# Altium schematic sheet RP2040 Core Sheet.SchDoc
size B; SheetNumber: 3; SheetTotal: 5
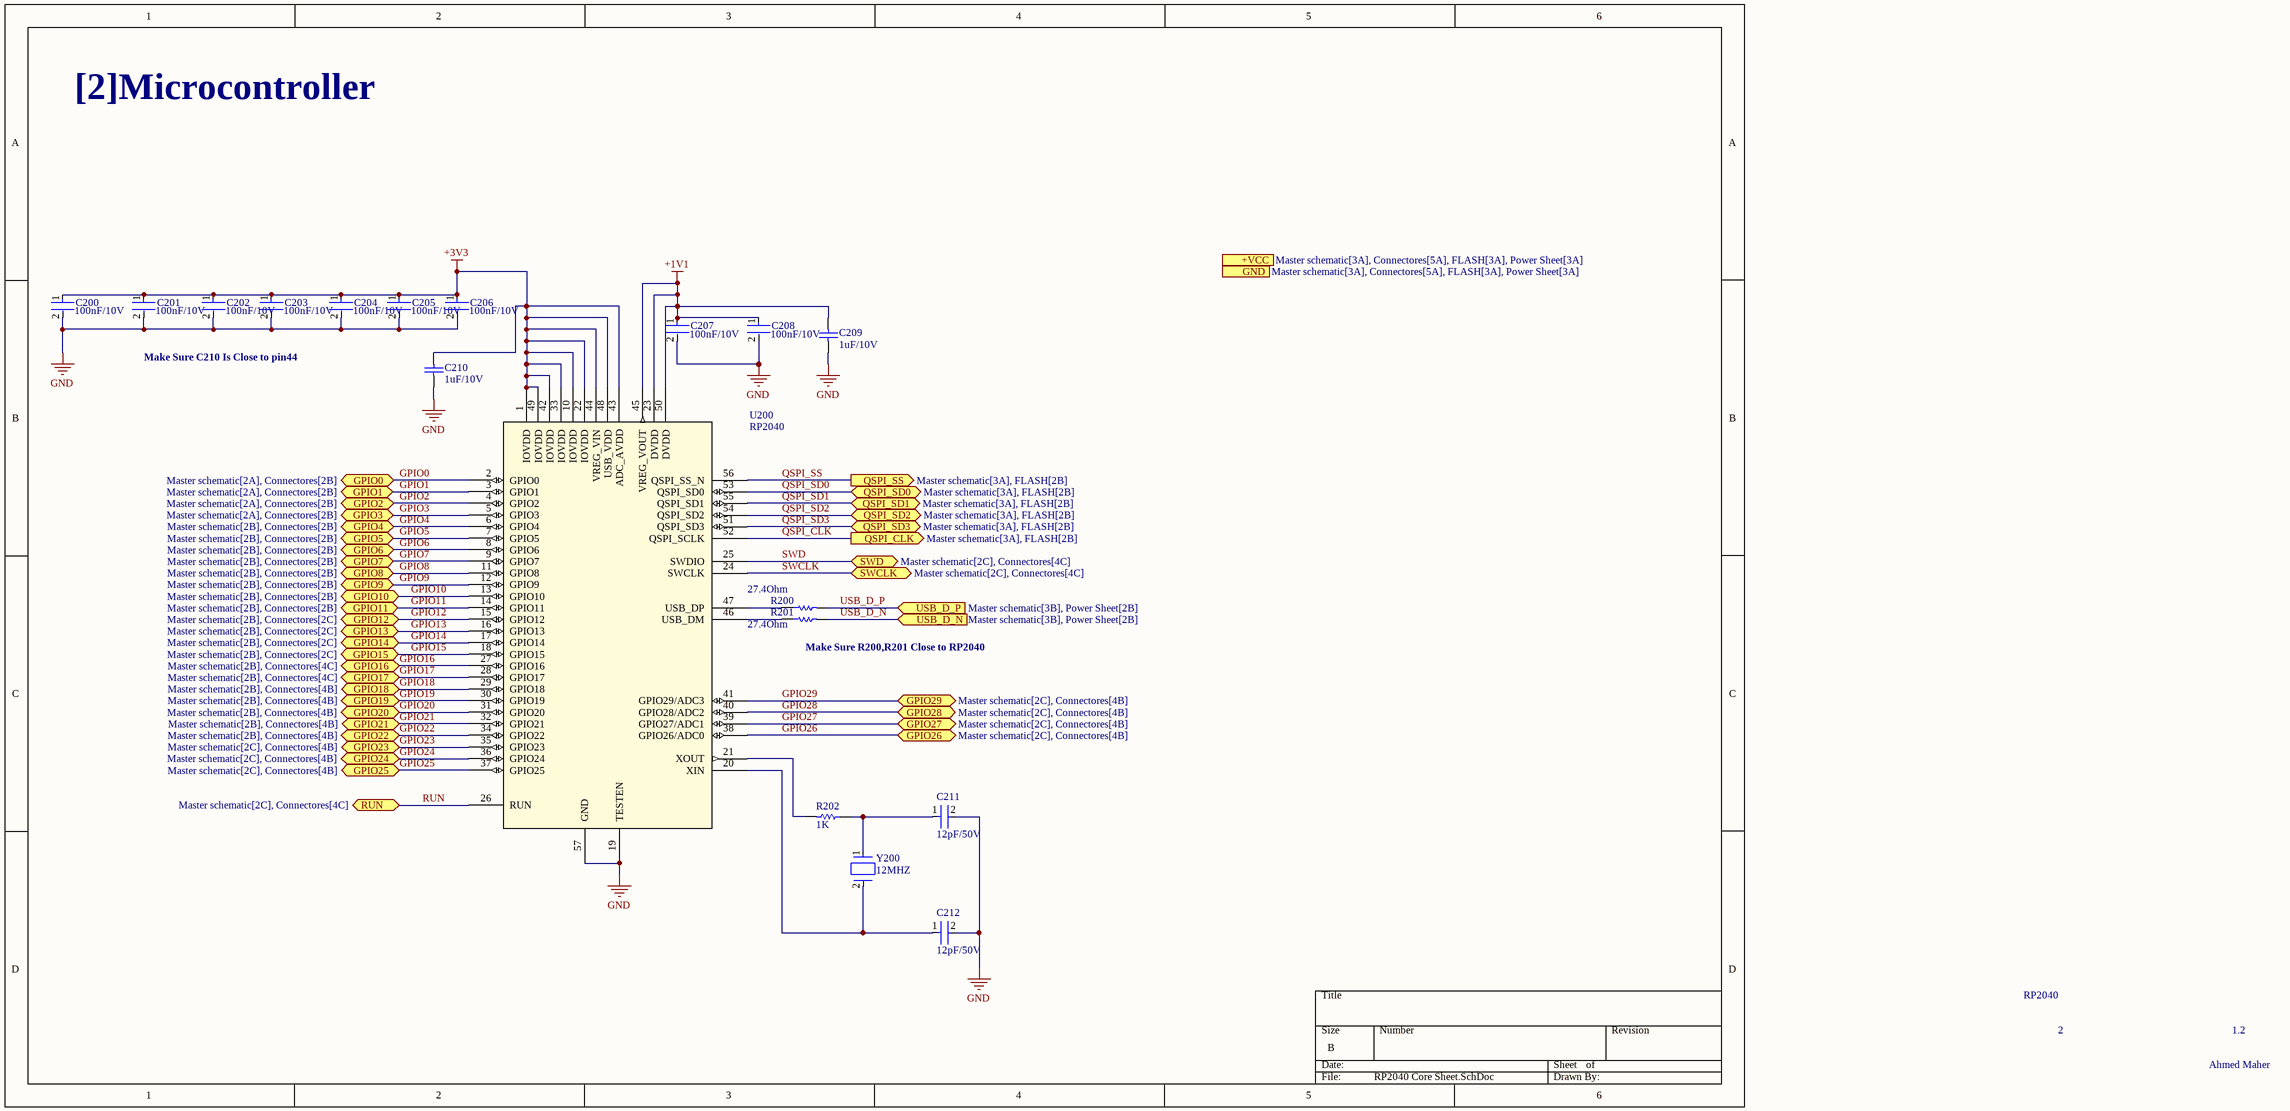
[diagram p0: RP2040 Core Sheet.SchDoc]

## Parts
C200  C0402C104K8PACTU  [FP-C0402-BB-MFG]  (value not drawn)
C201  C0402C104K8PACTU  [FP-C0402-BB-MFG]  (value not drawn)
C202  C0402C104K8PACTU  [FP-C0402-BB-MFG]  (value not drawn)
C203  C0402C104K8PACTU  [FP-C0402-BB-MFG]  (value not drawn)
C204  C0402C104K8PACTU  [FP-C0402-BB-MFG]  (value not drawn)
C205  C0402C104K8PACTU  [FP-C0402-BB-MFG]  (value not drawn)
C206  C0402C104K8PACTU  [FP-C0402-BB-MFG]  (value not drawn)
C207  C0402C104K8PACTU  [FP-C0402-BB-MFG]  (value not drawn)
C208  C0402C104K8PACTU  [FP-C0402-BB-MFG]  (value not drawn)
C209  1uF/10V  [CAPC1608X87X35LL15T15]
C210  1uF/10V  [CAPC1608X87X35LL15T15]
C211  12pF/50V  [FP-CC0603-0_9-MFG]
C212  12pF/50V  [FP-CC0603-0_9-MFG]
R200  RC0603FR-07274RL  [RESC1608X55X25NL10T15]  (value not drawn)
R201  RC0603FR-07274RL  [RESC1608X55X25NL10T15]  (value not drawn)
R202  1K  [RESC2013X60X35ML10T20]
U200  RP2040  [IC57_RP2040]
Y200  12MHZ  [FP-7A-MFG]

## Ports
+VCC (see Master schematic[3A], Connectores[5A], FLASH[3A], Power Sheet[3A]), GND (see Master schematic[3A], Connectores[5A], FLASH[3A], Power Sheet[3A]), GPIO0 (bidir, see Master schematic[2A], Connectores[2B]), GPIO1 (bidir, see Master schematic[2A], Connectores[2B]), GPIO2 (bidir, see Master schematic[2A], Connectores[2B]), GPIO3 (bidir, see Master schematic[2A], Connectores[2B]), GPIO4 (bidir, see Master schematic[2B], Connectores[2B]), GPIO5 (bidir, see Master schematic[2B], Connectores[2B]), GPIO6 (bidir, see Master schematic[2B], Connectores[2B]), GPIO7 (bidir, see Master schematic[2B], Connectores[2B]), GPIO8 (bidir, see Master schematic[2B], Connectores[2B]), GPIO9 (bidir, see Master schematic[2B], Connectores[2B]), GPIO10 (bidir, see Master schematic[2B], Connectores[2B]), GPIO11 (bidir, see Master schematic[2B], Connectores[2B]), GPIO12 (bidir, see Master schematic[2B], Connectores[2C]), GPIO13 (bidir, see Master schematic[2B], Connectores[2C]), GPIO14 (bidir, see Master schematic[2B], Connectores[2C]), GPIO15 (bidir, see Master schematic[2B], Connectores[2C]), GPIO16 (bidir, see Master schematic[2B], Connectores[4C]), GPIO17 (bidir, see Master schematic[2B], Connectores[4C]), GPIO18 (bidir, see Master schematic[2B], Connectores[4B]), GPIO19 (bidir, see Master schematic[2B], Connectores[4B]), GPIO20 (bidir, see Master schematic[2B], Connectores[4B]), GPIO21 (bidir, see Master schematic[2B], Connectores[4B]), GPIO22 (bidir, see Master schematic[2B], Connectores[4B]), GPIO23 (bidir, see Master schematic[2C], Connectores[4B]), GPIO24 (bidir, see Master schematic[2C], Connectores[4B]), GPIO25 (bidir, see Master schematic[2C], Connectores[4B]), GPIO26 (bidir, see Master schematic[2C], Connectores[4B]), GPIO27 (bidir, see Master schematic[2C], Connectores[4B]), GPIO28 (bidir, see Master schematic[2C], Connectores[4B]), GPIO29 (bidir, see Master schematic[2C], Connectores[4B]), QSPI_CLK (out, see Master schematic[3A], FLASH[2B]), QSPI_SD0 (bidir, see Master schematic[3A], FLASH[2B]), QSPI_SD1 (bidir, see Master schematic[3A], FLASH[2B]), QSPI_SD2 (bidir, see Master schematic[3A], FLASH[2B]), QSPI_SD3 (bidir, see Master schematic[3A], FLASH[2B]), QSPI_SS (out, see Master schematic[3A], FLASH[2B]), RUN (bidir, see Master schematic[2C], Connectores[4C]), SWCLK (bidir, see Master schematic[2C], Connectores[4C]), SWD (bidir, see Master schematic[2C], Connectores[4C]), USB_D_N (in, see Master schematic[3B], Power Sheet[2B]), USB_D_P (in, see Master schematic[3B], Power Sheet[2B])

## Nets
+1V1: C207.1 C208.1 C209.1 U200.23(DVDD) U200.45(VREG_VOUT) U200.50(DVDD)
+3V3: C200.1 C201.1 C202.1 C203.1 C204.1 C205.1 C206.1 C210.1 U200.1(IOVDD) U200.10(IOVDD) U200.22(IOVDD) U200.33(IOVDD) U200.42(IOVDD) U200.43(ADC_AVDD) U200.44(VREG_VIN) U200.48(USB_VDD) U200.49(IOVDD)
GND: C200.2 C201.2 C202.2 C203.2 C204.2 C205.2 C206.2 C207.2 C208.2 C209.2 C210.2 C211.2 C212.2 U200.19(TESTEN) U200.57(GND)
GPIO0: U200.2(GPIO0) ; port GPIO0
GPIO1: U200.3(GPIO1) ; port GPIO1
GPIO2: U200.4(GPIO2) ; port GPIO2
GPIO3: U200.5(GPIO3) ; port GPIO3
GPIO4: U200.6(GPIO4) ; port GPIO4
GPIO5: U200.7(GPIO5) ; port GPIO5
GPIO6: U200.8(GPIO6) ; port GPIO6
GPIO7: U200.9(GPIO7) ; port GPIO7
GPIO8: U200.11(GPIO8) ; port GPIO8
GPIO9: U200.12(GPIO9) ; port GPIO9
GPIO10: U200.13(GPIO10) ; port GPIO10
GPIO11: U200.14(GPIO11) ; port GPIO11
GPIO12: U200.15(GPIO12) ; port GPIO12
GPIO13: U200.16(GPIO13) ; port GPIO13
GPIO14: U200.17(GPIO14) ; port GPIO14
GPIO15: U200.18(GPIO15) ; port GPIO15
GPIO16: U200.27(GPIO16) ; port GPIO16
GPIO17: U200.28(GPIO17) ; port GPIO17
GPIO18: U200.29(GPIO18) ; port GPIO18
GPIO19: U200.30(GPIO19) ; port GPIO19
GPIO20: U200.31(GPIO20) ; port GPIO20
GPIO21: U200.32(GPIO21) ; port GPIO21
GPIO22: U200.34(GPIO22) ; port GPIO22
GPIO23: U200.35(GPIO23) ; port GPIO23
GPIO24: U200.36(GPIO24) ; port GPIO24
GPIO25: U200.37(GPIO25) ; port GPIO25
GPIO26: U200.38(GPIO26/ADC0) ; port GPIO26
GPIO27: U200.39(GPIO27/ADC1) ; port GPIO27
GPIO28: U200.40(GPIO28/ADC2) ; port GPIO28
GPIO29: U200.41(GPIO29/ADC3) ; port GPIO29
QSPI_CLK: U200.52(QSPI_SCLK) ; port QSPI_CLK
QSPI_SD0: U200.53(QSPI_SD0) ; port QSPI_SD0
QSPI_SD1: U200.55(QSPI_SD1) ; port QSPI_SD1
QSPI_SD2: U200.54(QSPI_SD2) ; port QSPI_SD2
QSPI_SD3: U200.51(QSPI_SD3) ; port QSPI_SD3
QSPI_SS: U200.56(QSPI_SS_N) ; port QSPI_SS
RUN: U200.26(RUN) ; port RUN
SWCLK: U200.24(SWCLK) ; port SWCLK
SWD: U200.25(SWDIO) ; port SWD
USB_D_N: R201.2 ; port USB_D_N
USB_D_P: R200.2 ; port USB_D_P
NetC211_1: C211.1 R202.1 Y200.1
NetC212_1: C212.1 U200.20(XIN) Y200.2
NetR200_1: R200.1 U200.47(USB_DP)
NetR201_1: R201.1 U200.46(USB_DM)
NetR202_2: R202.2 U200.21(XOUT)

## Notes on the sheet
- [2]Microcontroller
- (near C200) 100nF/10V
- 100nF/10V
- (near C203) 100nF/10V
- (near C205) 100nF/10V
- (near C206) 100nF/10V
- Make Sure C210 Is Close to pin44
- (near C207) 100nF/10V
- 27.4Ohm
- Make Sure R200,R201 Close to RP2040
- RP2040
- 2
- Ahmed Maher
- 1.2

## Library data of the parts
C200-C208 = CMP-2008-02046-2: CAP CER 0.1UF 10V X5R 0402; Manufacturer: Kemet; Material: Ceramic; Capacitance: 0.10 μF; Temperature Coefficient: 15%; Tolerance: 0.1; Value: 0.10 μF; Package: C0402-BB; Temperature: -55°C to +125°C; ComponentLink2Description: Datasheet; Temperature Characteristic: X5R; Device Class L1: Passive Components; Height: 0.55mm; Lead Free: Yes; ComponentLink2URL: https://content.kemet.com/datasheets/KEM_C1002_X7R_SMD.pdf; Device Class L2: Capacitors; Temperature Range Low: -55°C; Temperature Range High: +125°C; RoHS: TRUE; Octopart: https://octopart.com/c0402c104k8pactu-kemet-140039; Automotive: No; Mouser Description: Capacitor 100 nF 10 VDC 0402; Category: Cap; Voltage Rating: 10 V; Digikey Description: CAP CER 0.1UF 10V X5R 0402; Ipc Land Pattern Name: CAPC10050X50; Device Class L3: Ceramic Capacitors; Manufacturer Part Number: C0402C104K8PACTU
C209 C210 = CMP-2006-03713-1: Part Number: C0603C105K3RACTU; Manufacturer: Kemet
C211 C212 = CMP-03422-001493-1: CAP CER 15PF 50V C0G/NPO 0603; Insulation Resistance: 100GR; Tolerance: 5%; Dielectric: C0G; Dielectric Material: Ceramic; Series: CC; Height: 0.8mm; Number of Pins: 2; Max Operating Temperature: 125°C; Width: 0.031inch; Length: 1.6mm; Mount: Surface Mount; Packaging: Tape and Reel; RoHS Compliant: Yes; Radiation Hardening: No; Voltage Rating: 50V; Min Operating Temperature: -55°C; Case Code (Imperial): 0603; Case Code (Metric): 1608; Capacitance: 15pF; Termination: SMD/SMT; Lead Free: Lead Free; Depth: 0.8mm; Package Quantity: 1; Thickness: 0.035inch; Case/Package: 0603; REACH SVHC: No SVHC
R200 R201 = CMP-2000-03975-1: Manufacturer: Yageo; Part Number: RC0603FR-07274RL
R202 = CMP-2100-03671-1: Chip Resistor, 1 KOhm, +/- 1%, 125 mW, -55 to 155 degC, 0805 (2012 Metric), RoHS, Tape and Reel; Manufacturer: Yageo; Temperature Coefficient: 100ppm/degreesC; Voltage Rating (DC): 150V; Max Power Dissipation: 125mW; Resistance: 1KOhm; Number of Pins: 2; Number of Terminations: 2; Datasheet URL: http://www.yageo.com/NewPortal/yageodocoutput?fileName=/pdf/R-Chip/PYu-RC_Group_51_RoHS_L_5.pdf; Length: 0.079inch; Package Description: 2-Pin Surface Mounted Device, Body 2 x 1.25 mm; Depth: 1.25mm; Height: 0.024inch; Military Standard: Not; Case/Package: 0805; Package Reference: 0805; RoHSCompliant: true; Lead Free: LeadFree; Packaging: TapeandReel; Package Quantity: 1; Datasheet Version: Rev. 5, 10/2016; Tolerance: 1%; Min Operating Temperature: -55degC; Voltage Rating: 150V; Composition: ThickFilm; Case Code (Imperial): 0805; Power Rating: 125mW; Width: 0.049inch; Case Code (Metric): 2012; Manufacturer URL: http://www.yageo.com/; Max Operating Temperature: 155degC; REACH SVHC: Unknown; Termination: SMD/SMT
U200 = RP2040: No Description Available; Manufacturer_Name: Raspberry Pi; Copyright: Copyright (C) 2025 Ultra Librarian. All rights reserved.; Manufacturer_Part_Number: RP2040; RefDes: RefDes; Type: Type
Y200 = CMP-18717-000024-1: Quartz Crystal 12MHz, 30ppm, 12pF, 80Ω; ESR (Equivalent Series Resistance): 80R; Package Quantity: 1; Frequency: 12MHz; Tolerance: 30ppm; Min Operating Temperature: -20°C; Packaging: Tape and Reel; Max Operating Temperature: 85°C; RoHS Compliant: Yes; Frequency Stability: 30ppm; Width: 0.126inch; Number of Pins: 2; Frequency Tolerance: 30ppm; Series: 7A; Load Capacitance: 12pF; Height: 0.053inch; Depth: 3.2mm; Case/Package: SMD/SMT; Lead Free: Contains Lead; Mount: Surface Mount; Length: 5mm; Termination: SMD/SMT